# Altium schematic sheet LEDMatrix.SchDoc
size A; SheetNumber: 2; SheetTotal: 6
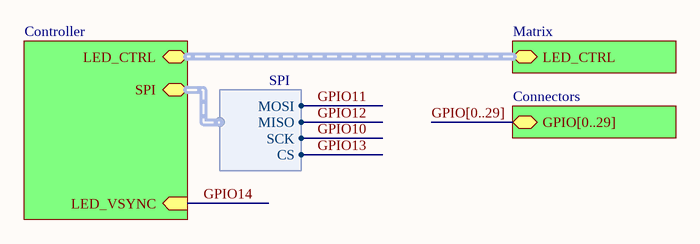
[diagram p0: LEDMatrix.SchDoc]

## Sub-sheets
Connectors = Connectors.SchDoc: GPIO[0..29] (bidir)
Controller = Controller.SchDoc: LED_CTRL (bidir, harness LED_CTRL), LED_VSYNC (in), SPI (bidir, harness SPI)
Matrix = Matrix.SchDoc: LED_CTRL (bidir, harness LED_CTRL)

## Harnesses
SPI: MOSI, MISO, SCK, CS

## Nets
GPIO10: sheet Controller/SPI.SCK
GPIO11: sheet Controller/SPI.MOSI
GPIO12: sheet Controller/SPI.MISO
GPIO13: sheet Controller/SPI.CS
GPIO14: sheet Controller/LED_VSYNC

## Buses and harness runs
bus GPIO[0..29] = sheet Connectors/GPIO[0..29]
harness sheet Controller/LED_CTRL = sheet Matrix/LED_CTRL

## Notes on the sheet
- Drawn By: =DrawnBy